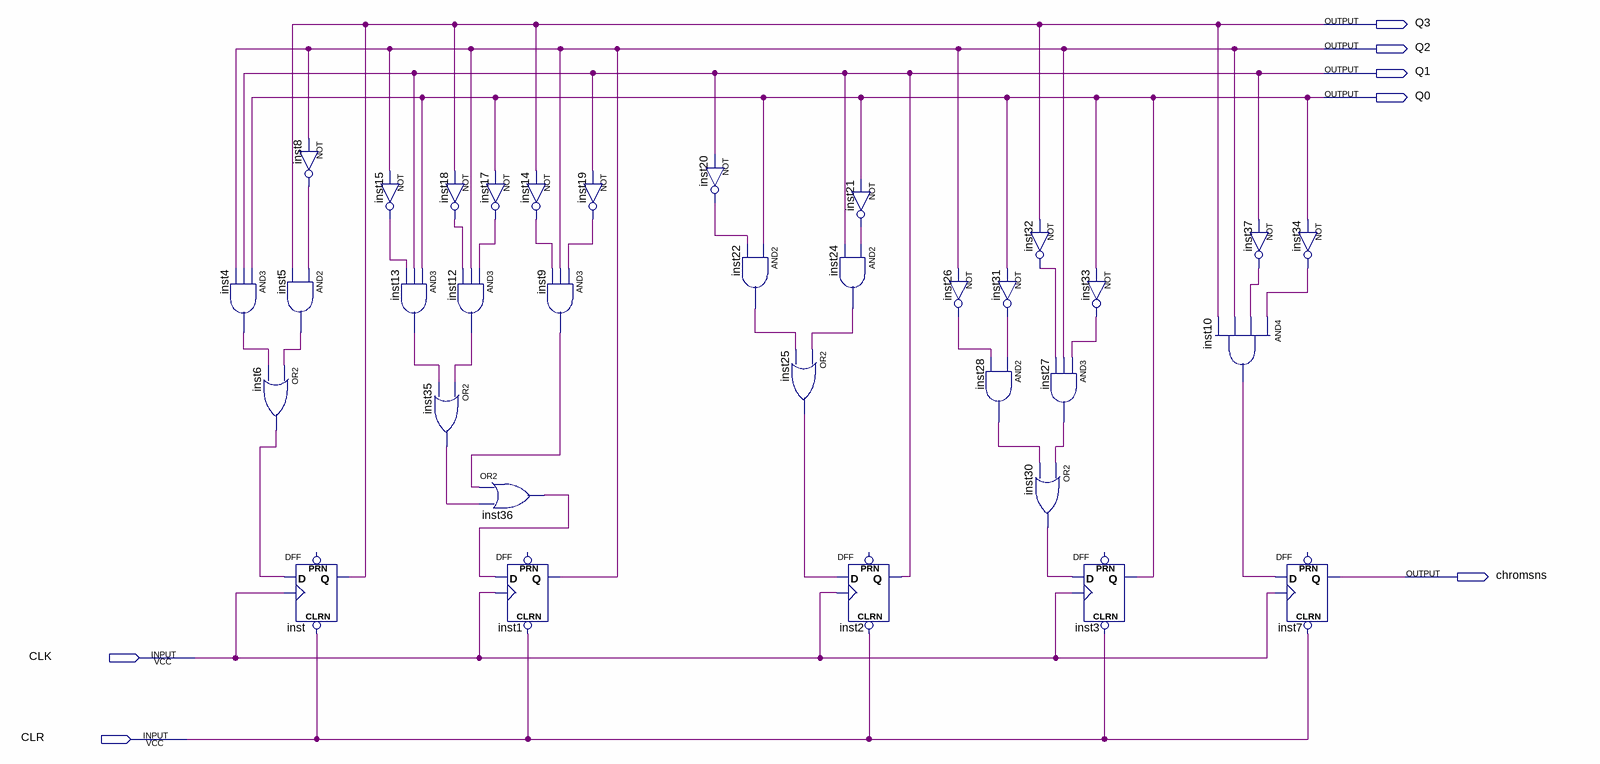
[diagram p0: schematic sheet]
// Quartus schematic ChromaticSense.bdf as structural Verilog: 34 symbols, 7 pins
module ChromaticSense (
  input  CLK,
  input  CLR,
  output Q3,
  output Q2,
  output Q1,
  output Q0,
  output chromsns
);

  wire inst4_out, inst5_out, inst6_out, inst8_out, inst9_out, inst10_out, inst12_out, inst13_out, inst14_out,
       inst15_out, inst17_out, inst18_out, inst19_out, inst20_out, inst21_out, inst22_out, inst24_out,
       inst25_out, inst26_out, inst27_out, inst28_out, inst30_out, inst31_out, inst32_out, inst33_out,
       inst34_out, inst35_out, inst36_out, inst37_out;

  and inst4 (inst4_out, Q0, Q1, Q2);
  not inst8 (inst8_out, Q2);
  and inst5 (inst5_out, inst8_out, Q3);
  or inst6 (inst6_out, inst5_out, inst4_out);
  DFF inst (.CLRN(CLR), .CLK(CLK), .D(inst6_out), .Q(Q3));  // open: PRN
  not inst15 (inst15_out, Q2);
  not inst18 (inst18_out, Q3);
  and inst13 (inst13_out, Q0, Q1, inst15_out);
  or inst35 (inst35_out, inst12_out, inst13_out);
  not inst17 (inst17_out, Q0);
  and inst12 (inst12_out, inst17_out, Q2, inst18_out);
  or inst36 (inst36_out, inst9_out, inst35_out);
  DFF inst1 (.CLRN(CLR), .CLK(CLK), .D(inst36_out), .Q(Q2));  // open: PRN
  not inst14 (inst14_out, Q3);
  and inst9 (inst9_out, inst19_out, Q2, inst14_out);
  not inst19 (inst19_out, Q1);
  not inst20 (inst20_out, Q1);
  and inst22 (inst22_out, Q0, inst20_out);
  and inst24 (inst24_out, inst21_out, Q1);
  or inst25 (inst25_out, inst24_out, inst22_out);
  not inst21 (inst21_out, Q0);
  DFF inst2 (.CLRN(CLR), .CLK(CLK), .D(inst25_out), .Q(Q1));  // open: PRN
  not inst26 (inst26_out, Q2);
  not inst32 (inst32_out, Q3);
  not inst31 (inst31_out, Q0);
  and inst28 (inst28_out, inst31_out, inst26_out);
  or inst30 (inst30_out, inst27_out, inst28_out);
  not inst33 (inst33_out, Q0);
  and inst27 (inst27_out, inst33_out, Q2, inst32_out);
  DFF inst3 (.CLRN(CLR), .CLK(CLK), .D(inst30_out), .Q(Q0));  // open: PRN
  and inst10 (inst10_out, inst34_out, inst37_out, Q2, Q3);
  not inst37 (inst37_out, Q1);
  DFF inst7 (.CLRN(CLR), .CLK(CLK), .D(inst10_out), .Q(chromsns));  // open: PRN
  not inst34 (inst34_out, Q0);
endmodule
